# Altium schematic sheet 第二路数字隔离原理图.SchDoc
size A4
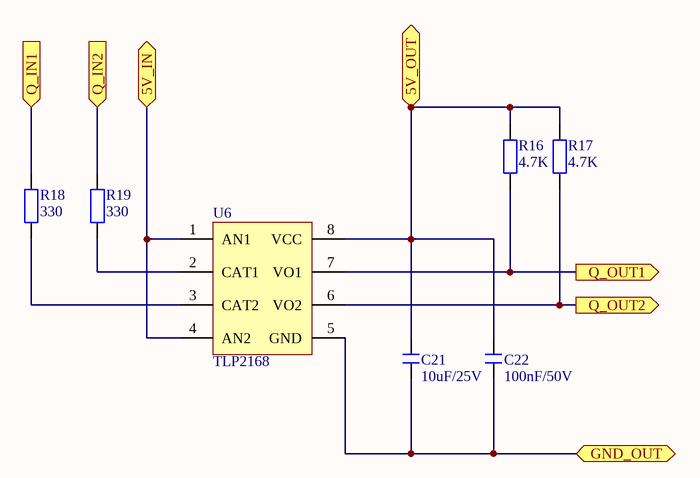
[diagram p0: 第二路数字隔离原理图.SchDoc]

## Parts
C21  10uF/25V  [C 0603_M]
C22  100nF/50V  [C 0603_M]
R16  4.7K  [R 0603_M]
R17  4.7K  [R 0603_M]
R18  330  [R 0603_M]
R19  330  [R 0603_M]
U6  TLP2168  [SOP8_N]

## Ports
5V_IN (bidir), 5V_OUT (bidir), GND_OUT (bidir), Q_IN1 (in), Q_IN2 (in), Q_OUT1 (out), Q_OUT2 (out)

## Nets
5V_IN: U6.1(AN1) U6.4(AN2) ; port 5V_IN
5V_OUT: C21.1 C22.2 R16.2 R17.2 U6.8(VCC) ; port 5V_OUT
GND_OUT: C21.2 C22.1 U6.5(GND) ; port GND_OUT
Q_IN1: R18.2 ; port Q_IN1
Q_IN2: R19.2 ; port Q_IN2
Q_OUT1: R16.1 U6.7(VO1) ; port Q_OUT1
Q_OUT2: R17.1 U6.6(VO2) ; port Q_OUT2
NetR18_1: R18.1 U6.3(CAT2)
NetR19_1: R19.1 U6.2(CAT1)

## Library data of the parts
C21 C22 = C: 无极性贴片电容; 版权归属: 源创客; 材质: X7R; BOM名称: 无极性贴片电容; 学习资源: www.ooocke.com
R16-R19 = R: 贴片电阻; 版权归属: 源创客; BOM名称: 贴片电阻; 学习资源: www.ooocke.com
U6 = TLP2168: 高速双通道隔离光耦